# Altium project Pressure_gauge_V3.0.PrjPCB
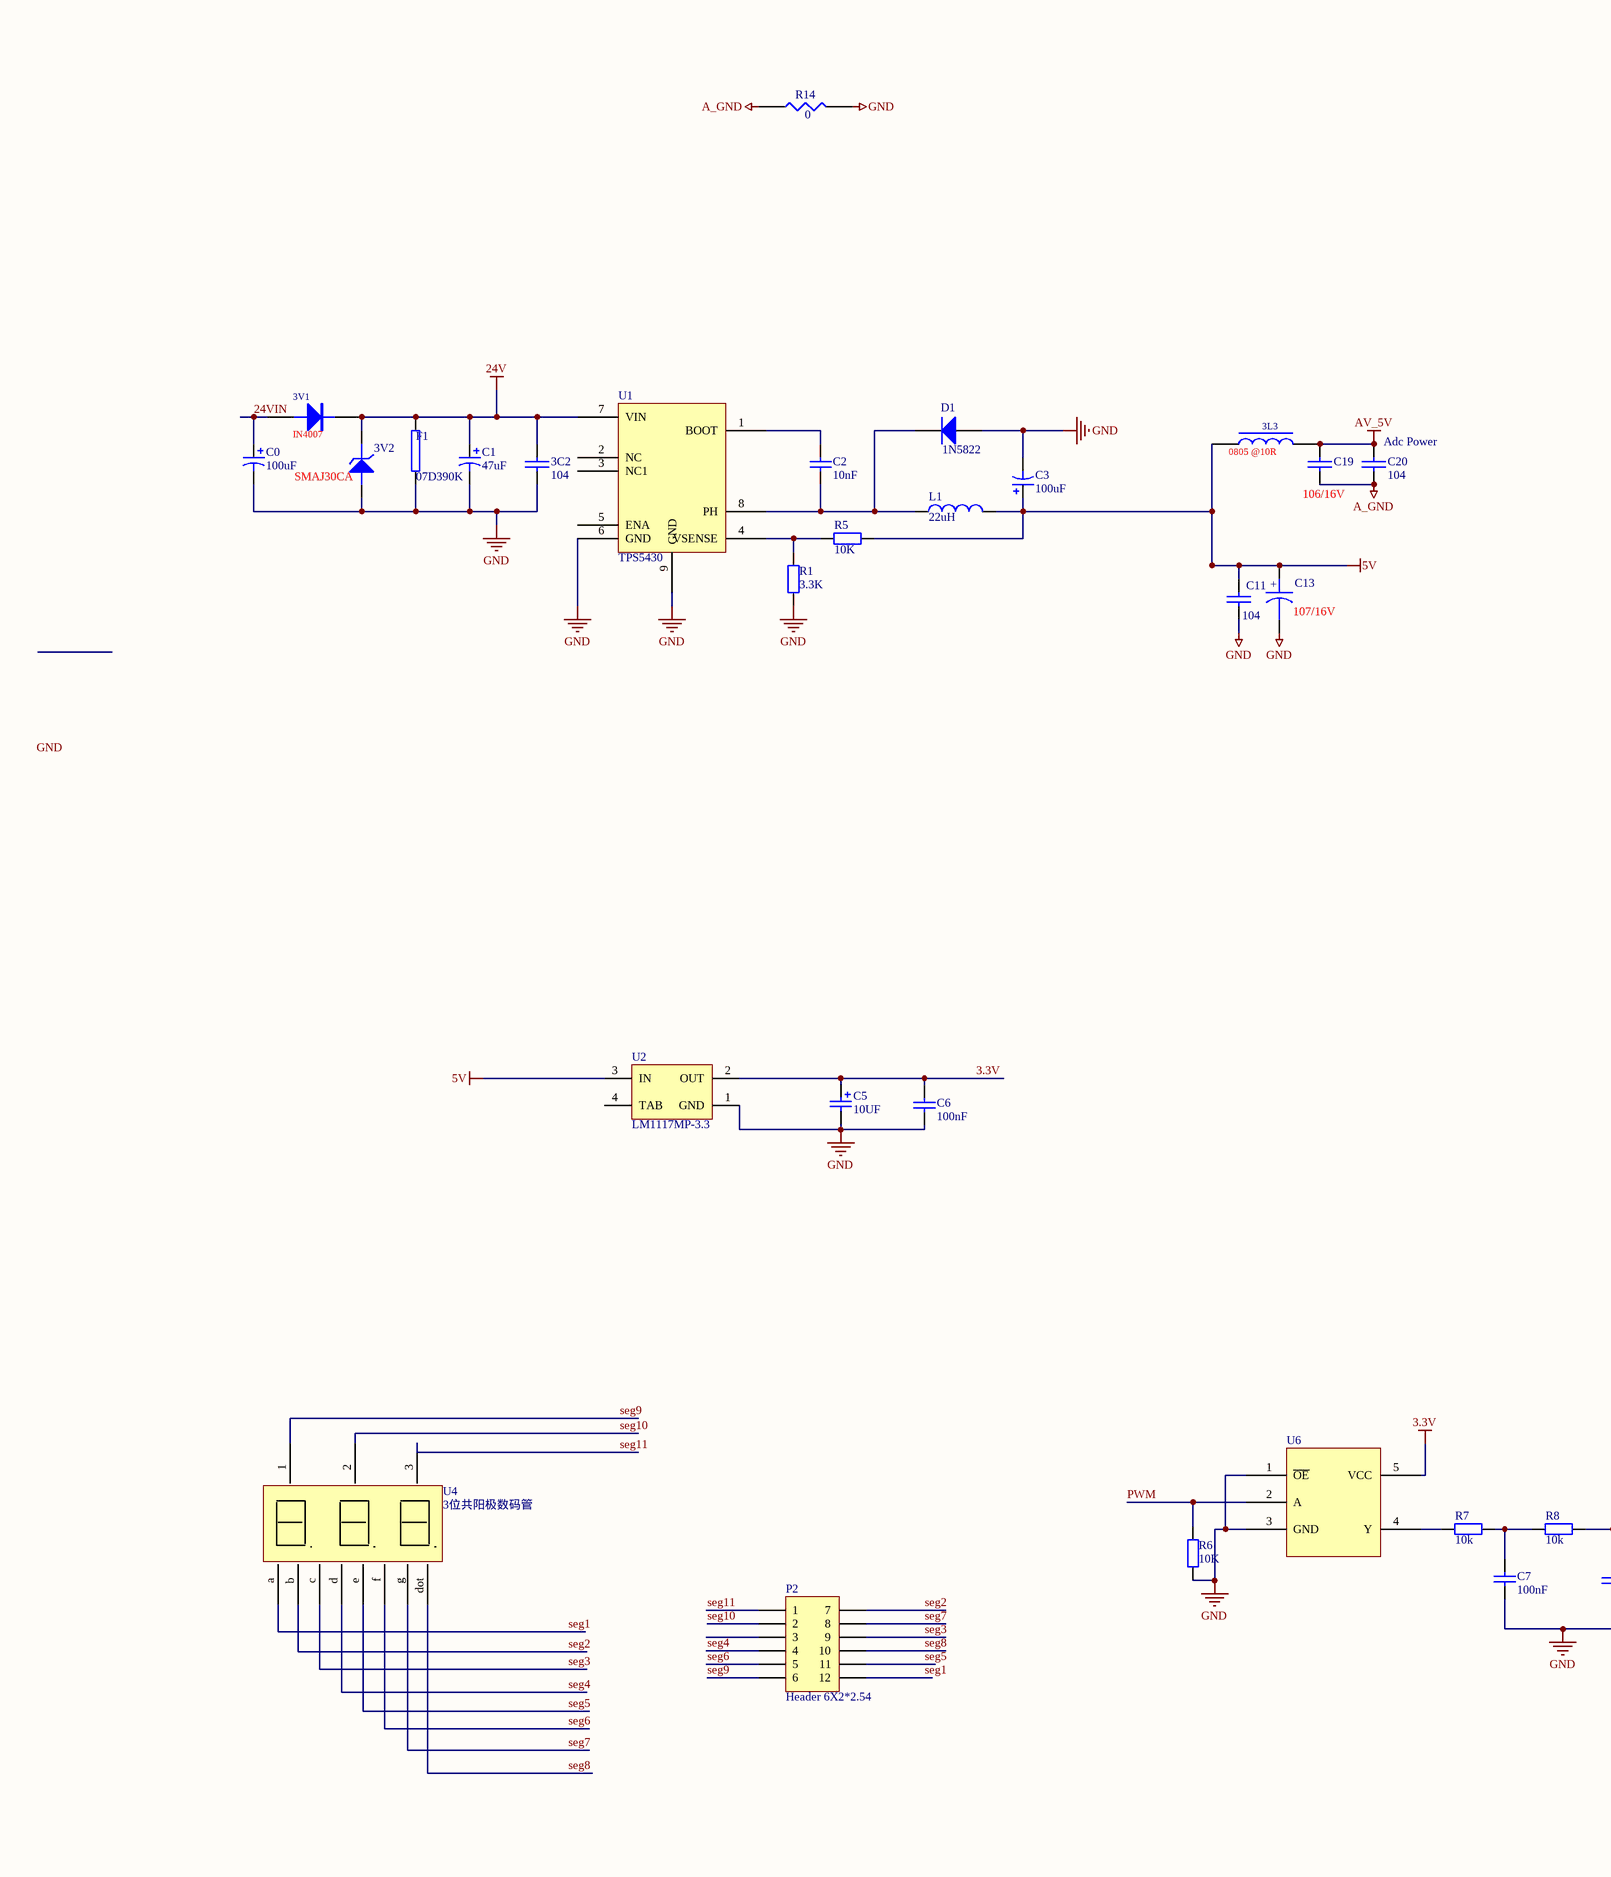
[diagram p0: Pressure_gauge_V3.0.SchDoc, left]
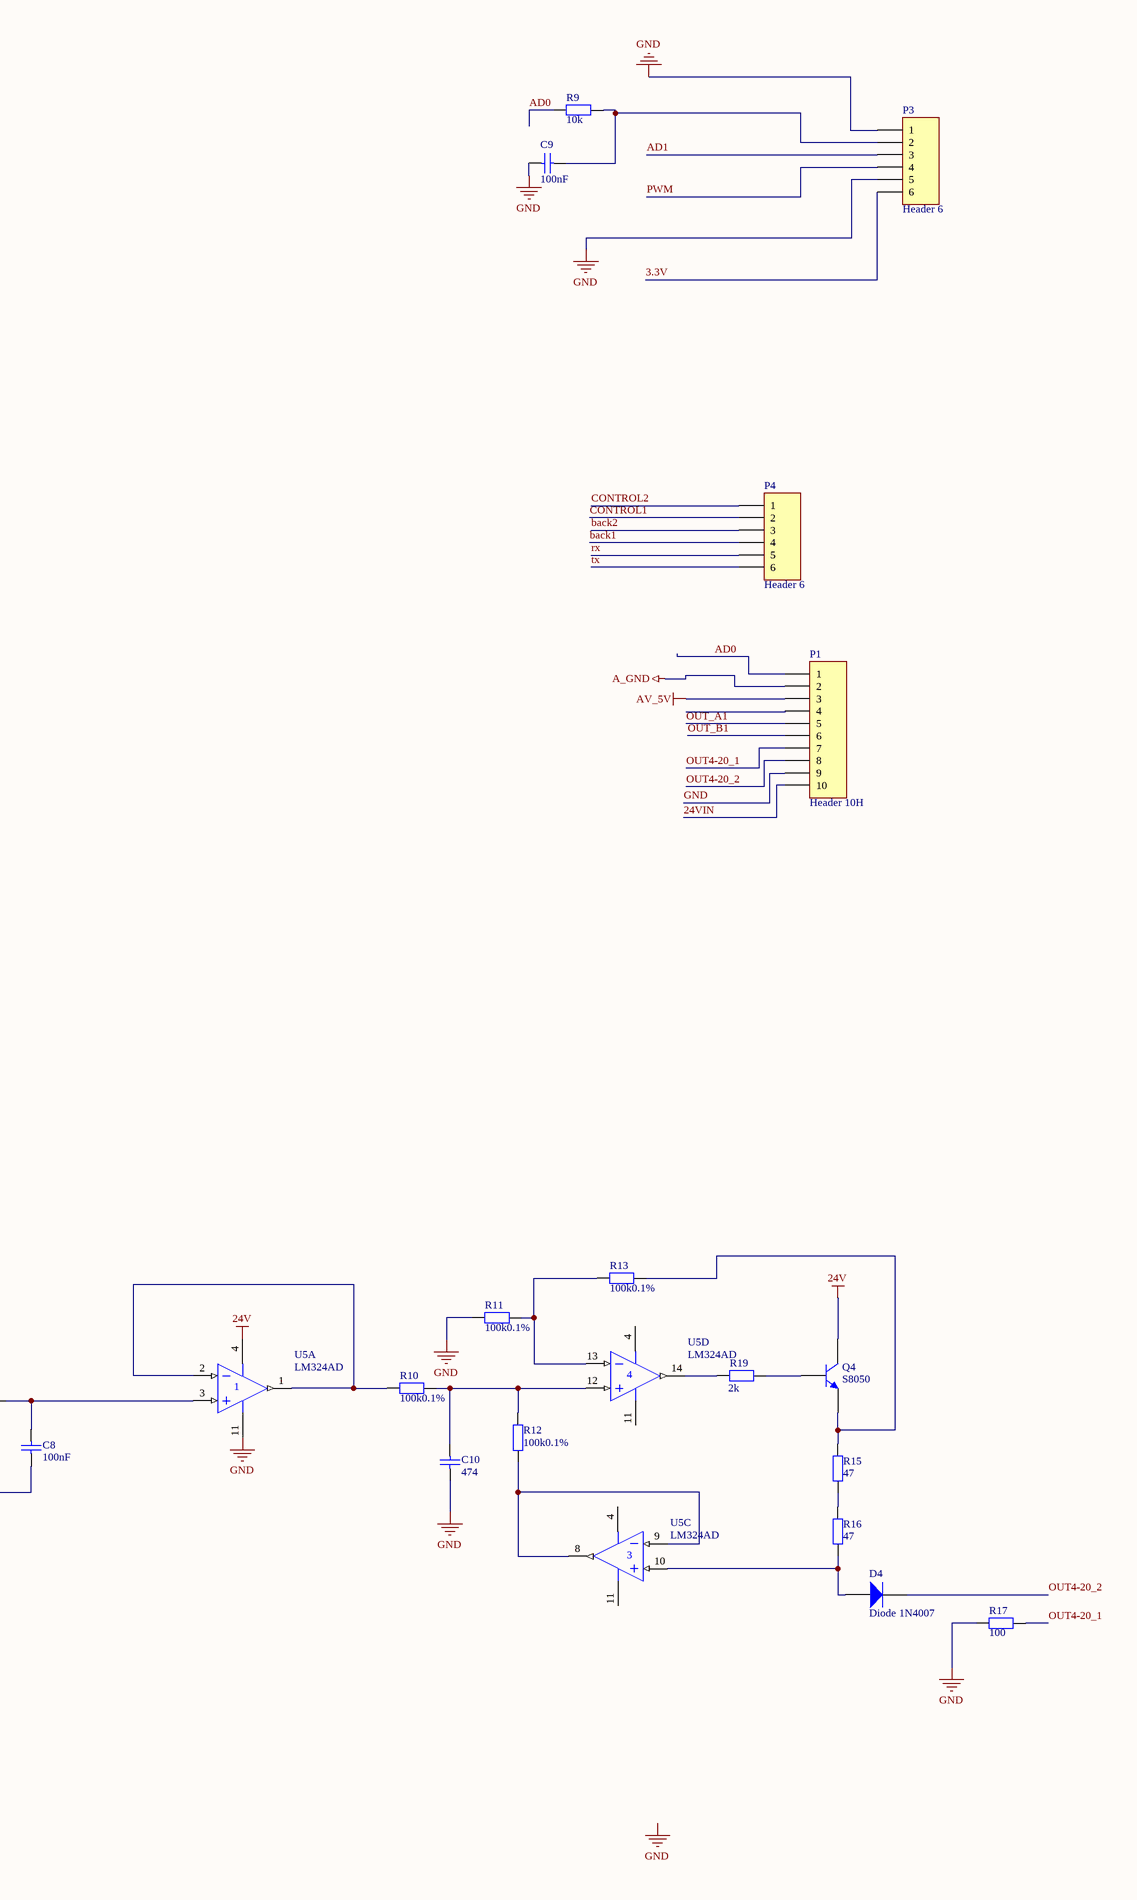
[diagram p1: Pressure_gauge_V3.0.SchDoc, right]
1 sheet, 47 parts. Net scope: global (net labels, ports and power ports of the same name join across sheets).
Board file: SEG_pressure gauge_don  V3.0.PcbDoc

## Sheet Pressure_gauge_V3.0.SchDoc
size A2

### Parts
3C2  104  [0805_C_Y]
3L3  0805 @10R  [SMDF4532]
3V1  IN4007  [DO-214AC]
3V2  SMAJ30CA  [DO-214AA]
C0  100uF  [D50]
C1  47uF  [3528 钽电容]
C2  10nF  [0805C]
C3  100uF  [1812-PPTC]
C5  10uf  [3216]
C6  100nf  [0805_C_Y]
C7  100nf  [0805_C_Y]
C8  100nf  [0805_C_Y]
C9  100nf  [0805_C_Y]
C10  474  [0805_C_Y]
C11  104  [0805_C_Y]
C13  107/16V  [3216]
C19  106/16V  [XM_ELE_TA_C_6032]
C20  104  [0805_C_Y]
D1  1N5822  [SMB]
D4  Diode 1N4007  [DO-214]
F1  07D390K  [FUSE-220]
L1  22uH  [SMDRH74]
P1  Header 10H  [HDR1X10H]
P2  Header 6X2*2.54  [HDR2X6_CEN]
P3  Header 6  [HDR1X6]
P4  Header 6  [HDR1X6]
Q4  S8050  [SOT-23_Y]
R1  3.3K  [0805R]
R5  10K  [0805R]
R6  10k  [0805_R_Y]
R7  10k  [0805_R_Y]
R8  10k  [0805_R_Y]
R9  10k  [0805_R_Y]
R10  100k0.1%  [0805_R_Y]
R11  100k0.1%  [0805_R_Y]
R12  100k0.1%  [0805_R_Y]
R13  100k0.1%  [0805_R_Y]
R14  0  [0805_R_Y]
R15  47  [0805_R_Y]
R16  47  [0805_R_Y]
R17  100  [0805_R_Y]
R19  2k  [0805_R_Y]
U1  TPS5430  [SO8NB]
U2  LM1117MP-3.3  [MP04A_M]
U4  3位共阳极数码管  [3位数码管0.56]
U5  LM324AD  [D014_N]  (parts A,C,D of 4)
U6  NC7SZ125  [SOT23-5]  (value not drawn)

### Nets
3.3V: C5.1 C6.1 P3.6 U2.2(OUT) U6.5(VCC)
5V: 3L3.1 C3.1 C11.1 C13.1 L1.2 R5.2 U2.3(IN)
24V: 3C2.1 3V1.2 3V2.2(K) C1.1 F1.1 Q4.3(C) U1.7(VIN) U5.4(V+)
A_GND: C19.2 C20.2 P1.2 R14.1
AV_5V: 3L3.2 C19.1 C20.1 P1.3
GND: 3C2.2 3V2.1(A) C0.2 C1.2 C3.2 C5.2 C6.2 C7.2 C8.2 C9.1 C10.2 C11.2 C13.2 D1.1(A) F1.2 P1.9 P3.1 P3.5 R1.1 R6.2 R11.2 R14.2 R17.2 U1.6(GND) U1.9(GND) U2.1(GND) U5.11(V-) U6.1(~{OE}) U6.3(GND)
24VIN: 3V1.1 C0.1 P1.10
AD0: P1.1 R9.2
AD1: P3.3
back1: P4.4
back2: P4.3
CONTROL1: P4.2
CONTROL2: P4.1
OUT4-20_1: P1.7 R17.1
OUT4-20_2: D4.2(K) P1.8
OUT_A1: P1.5
OUT_B1: P1.6
PWM: P3.4 R6.1 U6.2(A)
rx: P4.5
seg1: P2.12 U4.a
seg2: P2.7 U4.b
seg3: P2.9 U4.c
seg4: P2.4 U4.d
seg5: P2.11 U4.e
seg6: P2.5 U4.f
seg7: P2.8 U4.g
seg8: P2.10 U4.dot
seg9: P2.6 U4.1
seg10: P2.2 U4.2
seg11: P2.1 U4.3
tx: P4.6
NetC2_1: C2.1 D1.2(K) L1.1 U1.8(PH)
NetC2_2: C2.2 U1.1(BOOT)
NetC7_1: C7.1 R7.1 R8.2
NetC8_1: C8.1 R8.1 U5.3(IN+)
NetC9_2: C9.2 P3.2 R9.1
NetC10_1: C10.1 R10.1 R12.2 U5.12(IN+)
NetD4_1: D4.1(A) R16.2 U5.10(IN+)
NetQ4_1: Q4.1(B) R19.1
NetQ4_2: Q4.2(E) R13.1 R15.1
NetR1_2: R1.2 R5.1 U1.4(VSENSE)
NetR7_2: R7.2 U6.4(Y)
NetR10_2: R10.2 U5.1(OUT) U5.2(IN-)
NetR11_1: R11.1 R13.2 U5.13(IN-)
NetR12_1: R12.1 U5.8(OUT) U5.9(IN-)
NetR15_2: R15.2 R16.1
NetR19_2: R19.2 U5.14(OUT)

Not connected (* = marked no-connect by the designer): P1 4; P2 3; U1 2(NC) 3(NC1) 5(ENA); U2 4(TAB)

### Notes on the sheet
- (near C20) Adc Power
- Labels drawn without touching a wire or pin: GND
- (in symbol CAPACITOR POL) +

### Library data of the parts
3C2 C11 C19 C20 = CAP: Capacitor
3L3 = TRANS0: 磁珠
3V1 = DIODE
3V2 = ZENER3: Zener Diode
C0 C1 C3 = Cap Pol1: Polarized Capacitor (Radial); Published: 8-Jun-2000; LatestRevisionDate: 17-Jul-2002; LatestRevisionNote: Re-released for DXP Platform.; PackageReference: RB7.6-15; Publisher: Altium Limited
  C0 C3: Value: 100uF
  C1: Value: 47uF
C2 C6-C10 = Cap: Capacitor; Published: 8-Jun-2000; LatestRevisionDate: 17-Jul-2002; LatestRevisionNote: Re-released for DXP Platform.; PackageReference: RAD-0.3; Publisher: Altium Limited
  C2: Value: 10nF
  C6-C9: Value: 100nF
  C10: Value: 474
C5 = Cap Pol2: Polarized Capacitor (Axial); Published: 8-Jun-2000; LatestRevisionDate: 17-Jul-2002; LatestRevisionNote: Re-released for DXP Platform.; PackageReference: POLAR0.8; Publisher: Altium Limited; Value: 10UF
C13 = CAPACITOR POL: Capacitor
D1 = Diode 1N5408: 3 Amp Medium Power Silicon Rectifier Diode; Published: 8-Jun-2000; LatestRevisionDate: 17-Jul-2002; LatestRevisionNote: Re-released for DXP Platform.; DatasheetVersion: Aug-1984; PackageReference: DO-201AD; Publisher: Altium Limited; ComponentLink1Description: Manufacturer Link; ComponentLink1URL: http://www.irf.com/; Value: 1N5822
D4 = Diode 1N5402: 3 Amp General Purpose Rectifier; Published: 8-Jun-2000; LatestRevisionDate: 17-Jul-2002; LatestRevisionNote: Re-released for DXP Platform.; DatasheetVersion: 1998; PackageVersion: Aug-1999; PackageReference: DO-201AD; Publisher: Altium Limited; ComponentLink1Description: Manufacturer Link; ComponentLink1URL: http://www.fairchildsemi.com/; ComponentLink2Description: Datasheet; ComponentLink2URL: http://www.fairchildsemi.com/ds/1N%2F1N5400.pdf
F1 = RES2_S: RES
L1 = Inductor: Inductor CD74; Code_IEC: 1005; Published: 8-Jun-2000; LatestRevisionDate: 29-May-2009; LatestRevisionNote: IPC-7351 Footprint Added.; PackageReference: 0402-A; Publisher: Altium Limited; PackageDescription: Chip Inductor; Code_JEITA: 0402; Value: 22uH
P1 = Header 10H: Header, 10-Pin, Right Angle; LatestRevisionDate: 17-Jul-2002; LatestRevisionNote: Re-released for DXP Platform.; Publisher: Altium Limited
P2 = Header 6X2A: Header, 6-Pin, Dual row; LatestRevisionDate: 17-Jul-2002; LatestRevisionNote: Re-released for DXP Platform.; Publisher: Altium Limited
P3 P4 = Header 6: Header, 6-Pin; LatestRevisionDate: 17-Jul-2002; LatestRevisionNote: Re-released for DXP Platform.; Publisher: Altium Limited
Q4 = 2N3904: NPN General Purpose Amplifier; Published: 8-Jun-2000; LatestRevisionDate: 15-Jan-2003; LatestRevisionNote: PCB Footprint 'BCY-W3/D4.7' replaced; DatasheetVersion: 1997; PackageVersion: Sep-1998; PackageReference: TO-92A; Publisher: Altium Limited; Code_JEDEC: TO-92A; ComponentLink1Description: Manufacturer Link; ComponentLink1URL: http://www.fairchildsemi.com/; ComponentLink2Description: Datasheet; ComponentLink2URL: http://www.fairchildsemi.com/ds/2N%2F2N3904.pdf
R1 R5-R13 R15-R17 R19 = Res2: Resistor; Published: 8-Jun-2000; LatestRevisionDate: 17-Jul-2002; LatestRevisionNote: Re-released for DXP Platform.; PackageReference: AXIAL-0.4; Publisher: Altium Limited
  R1: Value: 3.3K
  R5 R6: Value: 10K
  R7-R9: Value: 10k
  R10-R13: Value: 100k0.1%
  R15 R16: Value: 47
  R17: Value: 100
  R19: Value: 2k
R14 = RES1
U1 = Component_1
U2 = LM1117MP-3.3: 800mA Low-Dropout Linear Regulator; Manufacturer: National Semiconductor; CompType: LDO IC; PackageTopMarking: XYTT*N05A; PowerWise: N; Published: 4-Dec-2008; DatasheetVersion: Apr-2006; PackageVersion: revB, Apr-2003; PackageReference: MP04A; Publisher: Altium Limited; PackageDescription: Molded SOT-223, 6.50 x 3.56 x 1.6mm Body, 4 Lead, 2.3mm Pitch; PartNumber: LM1117MP-3.3; RoHS: O; PinCount: 4; DigiKeyPartNumber: LM1117MP-3.3CT-ND; Code_JEDEC: TO-261-AA; Code_IPC: SOT223-4; ComponentLink1Description: LM1117 Datasheet; ComponentLink1URL: http://www.national.com/ds/LM/LM1117.pdf; ComponentLink2Description: LM1117 Web Page; ComponentLink2URL: http://www.national.com/pf/LM/LM1117.html; ComponentLink3Description: MP04A Package Page; ComponentLink3URL: http://www.national.com/packaging/folders/mp04a.html
U5 = LM324AD: Quadruple Operational Amplifier; Published: 15-Apr-2002; LatestRevisionDate: 13-Apr-2006; LatestRevisionNote: IPC-7351 Footprint Added.; DatasheetVersion: Jan-1989; PackageVersion: Jan-1998; PackageReference: D014; Publisher: Altium Limited; PackageDescription: 14-Pin Small Outline Integrated Circuit 1.27 mm Pitch; Code_IPC: SOIC127P600-14; ComponentLink1Description: Manufacturer Link; ComponentLink1URL: http://www.ti.com/; ComponentLink2Description: Datasheet; ComponentLink2URL: http://www-s.ti.com/sc/ds/lm324.pdf